# EasyEDA Pro project ProPrj_Neon_2025-07-07.epro

# Schematic Schematic1
Board Name: Board1; Create Date: 2025-03-22; Page Name: P1; Project Name: Neon; Schematic Name: Schematic1; Update Date: 2025-03-23; Company: EasyEDA.com; Page Size: A4; Version: V1.0
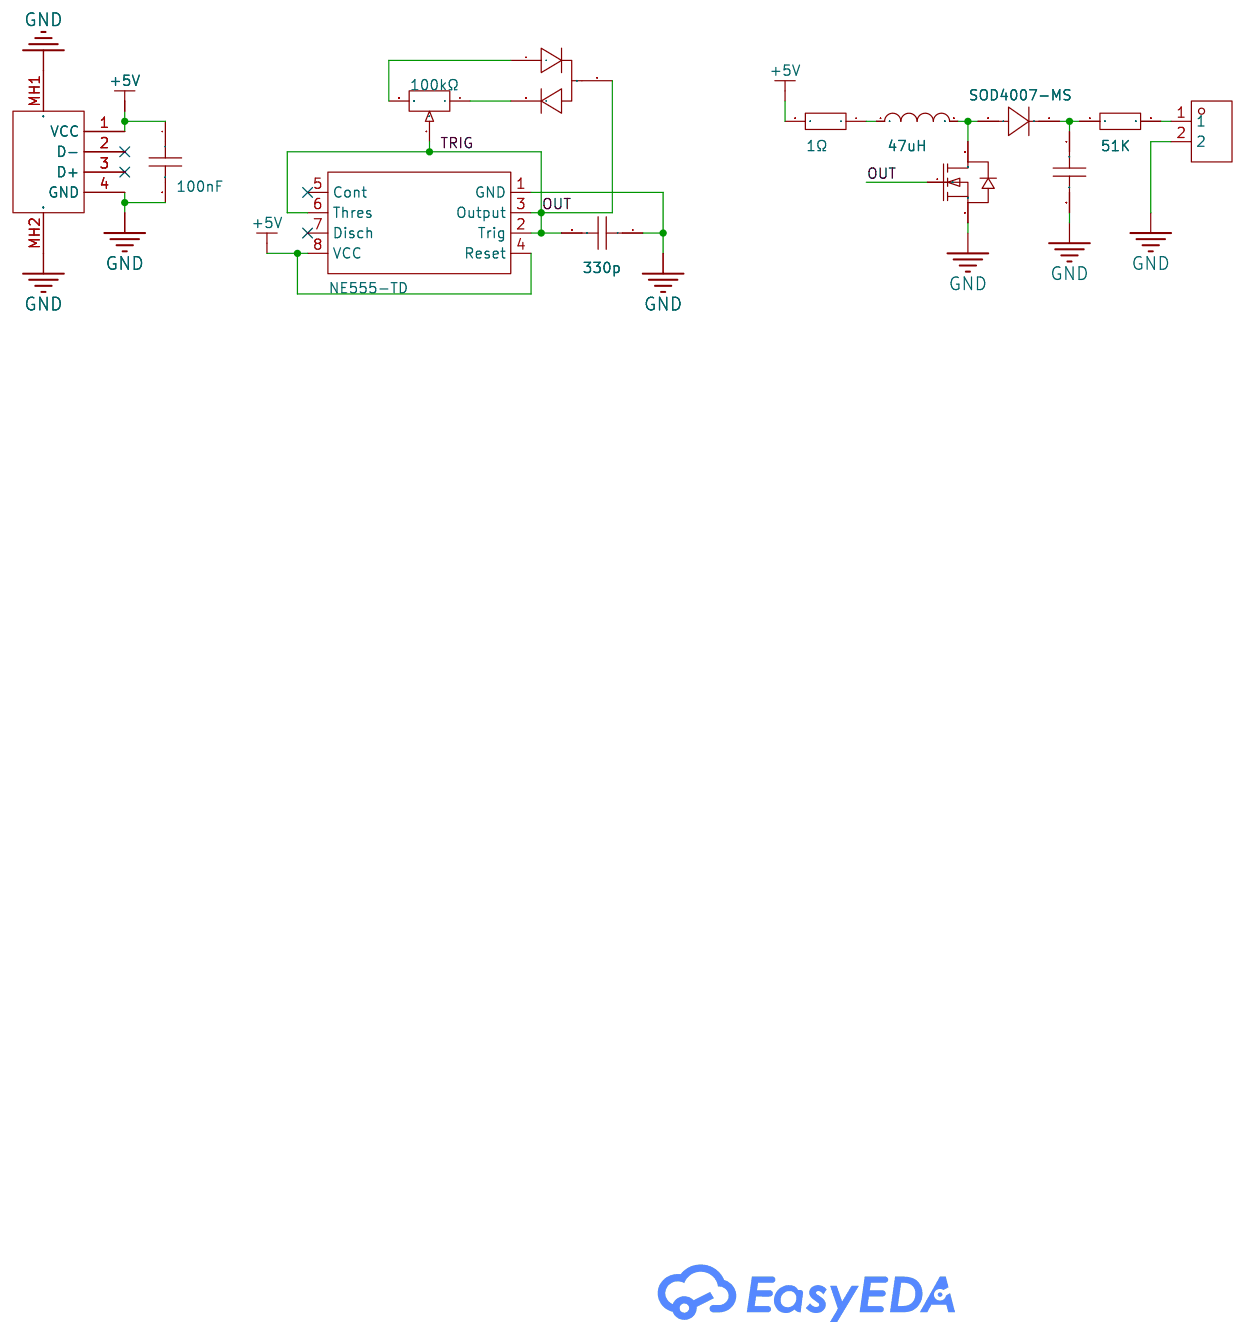
[diagram p0: schematic sheet]

## Parts
C1  330p  [C0603]
C2  100nF  [C0805]
C3  100nF  [C0603]
D2  SOD4007-MS  [SOD-123FL_L2.8-W1.8-LS3.7-RD]
Q1  BSS123W  [SOT-323-3_L2.0-W1.3-P1.30-LS2.3-BR]
R3  51K  [R0603]
R4  100kΩ  [RES-ADJ-TH_3P-L9.5-W4.9-P2.50-L_3296W]
R5  1Ω  [R0603]
U2  NE555-TD  [SOIC-8_L4.9-W3.9-P1.27-LS6.0-BL]
U3  DS1024-1x2R2  [HDR-TH_2P-P2.54-H-F-W10.0-N]
U4  BAV99  [SOT-23-3_L3.0-W1.7-P0.95-LS2.9-BR]
U5  47uH  [IND-TH_BD3.2-L7.0-P11.00-D0.5]
USB1  AM90  [USB-AM-TH_AM90]

## Library data of the parts
C1 C3 = CAP_0603: Supplier Footprint: 0603
C2 = AC0805JKX7R0BB104: Capacitance:100nF Tolerance:±5% Tolerance:±5% Voltage Rated: Temperature Coefficient:; LCSC Part Name: 100nF ±5% 100V; Supplier Part: C5936644; Manufacturer: YAGEO(国巨); Supplier Footprint: 0805; JLCPCB Part Class: Extended Part; Datasheet: https://atta.szlcsc.com/upload/public/pdf/source/20231121/23273F16EF68B848105A6B3182EA85EC.pdf; Supplier: LCSC; Tolerance: ±5%
D2 = SOD4007-MS: Diode Configuration: Reverse Voltage (Vr): Rectified Current: Reverse Leakage Current:10uA@1kV; LCSC Part Name: 电压:1kV 电流:1A; Supplier Part: C3008061; Manufacturer: MSKSEMI(美森科); Supplier Footprint: SOD-123FL; JLCPCB Part Class: Extended Part; Datasheet: https://atta.szlcsc.com/upload/public/pdf/source/20240508/03BE9FB150B205AAD58E954247BADD6D.pdf; Supplier: LCSC; Reverse Leakage Current: 10uA@1kV
Q1 = BSS123W: Type:1 N-channel Drain to Source Voltage: Current - Continuous Drain(Id): RDS(on):5.5Ω@4.5V,200mA Pd - Power Dissipation:150mW Gate Threshold Voltage (Vgs(th)@Id):2.5V Gate Charge(Qg):1.61nC@10V Input Capacitance(Ciss@Vds):32pF@50V Reverse Transfer Capaci; LCSC Part Name: 1个N沟道 耐压:100V 电流:200mA; Supplier Part: C919596; Manufacturer: YANGJIE(扬杰); Supplier Footprint: SOT-323(SC-70); JLCPCB Part Class: Extended Part; Datasheet: https://atta.szlcsc.com/upload/public/pdf/source/20201124/C919596_CD6FE2354D75AC43176E1098F69705B3.pdf; Supplier: LCSC; Type: 1 N-channel; RDS(on): 5.5Ω@4.5V,200mA; Pd - Power Dissipation: 150mW; Gate Threshold Voltage (Vgs(th)@Id): 2.5V; Gate Charge(Qg): 1.61nC@10V; Input Capacitance(Ciss@Vds): 32pF@50V; Reverse Transfer Capacitance (Crss@Vds): 7pF@50V; Operating Temperature: -55℃~+150℃
R3 = Res_0603: Supplier Footprint: 0603
R4 = 3296W-1-104_C118963: Resistance: Tolerance:±10% Tolerance:±10%; LCSC Part Name: 100kΩ ±10%; Supplier Part: C118963; Manufacturer: BOCHEN(博晨); Manufacturer Part: 3296W-1-104; Supplier Footprint: 插件; JLCPCB Part Class: Extended Part; Datasheet: https://atta.szlcsc.com/upload/public/pdf/source/20171114/C118963_15106326662041117450.pdf; Supplier: LCSC; Tolerance: ±10%
R5 = 0603WAF100KT5E: Type:Thick Film Resistors Resistance:1Ω Tolerance:±1% Tolerance:±1% Power(Watts): Overload Voltage (Max): Temperature Coefficient:±400ppm/℃ Temperature Coefficient:±400ppm/℃ Operating Temperature Range:-55℃~+155℃ Operating Temperature Range:-55℃~+155℃; LCSC Part Name: 1Ω ±1% 100mW 厚膜电阻; Supplier Part: C22936; Manufacturer: UNI-ROYAL(厚声); Supplier Footprint: 0603; JLCPCB Part Class: Basic Part; Datasheet: https://atta.szlcsc.com/upload/public/pdf/source/20200306/C422600_1E6D84923E4A46A82E41ADD87F860B5C.pdf; Supplier: LCSC; Type: Thick Film Resistors; Tolerance: ±1%; Temperature Coefficient: ±400ppm/℃; Operating Temperature Range: -55℃~+155℃
U2 = NE555-TD: Supplier Part: C42422057; Manufacturer: TDSEMIC(拓电半导体); Supplier Footprint: SOP-8; Datasheet: https://atta.szlcsc.com/upload/public/pdf/source/20241227/C1D0D1A1D654F129099568FEFDC0EC25.pdf; Supplier: LCSC
U3 = DS1024-1x2R2: Holes Structure:1x2P Pitch:2.54mm Mounting Type:Bend insert Number of Rows:Single Row Insulation Height:8.5mm Contact Plating:Nickel-plated; LCSC Part Name: 1x2P 间距:2.54mm 弯插 黑色; Supplier Part: C7509534; Manufacturer: CONNFLY; Supplier Footprint: 插件,P=2.54mm; JLCPCB Part Class: Extended Part; Datasheet: https://atta.szlcsc.com/upload/public/pdf/source/20230815/180A52BFD6617A57EE4D56A5DDB489B2.pdf; Supplier: LCSC; Holes Structure: 1x2P; Pitch: 2.54mm; Mounting Type: Bend insert; Number of Rows: Single Row; Insulation Height: 8.5mm; Contact Plating: Nickel-plated
U4 = BAV99_C22368863: Supplier Part: C22368863; Manufacturer: Wild Goose(威谷); Supplier Footprint: SOT-23; JLCPCB Part Class: Extended Part; Datasheet: https://atta.szlcsc.com/upload/public/pdf/source/20240624/F48F9993A5D8974EF570BB85214962A7.pdf; Supplier: LCSC
U5 = EC0410-470K: Inductance:47uH Tolerance:±10% Tolerance:±10% Current Rating:340mA DC Resistance(DCR):1.22Ω Type:Color Circle Coils Inductor Q @ Frequency:45@2.52MHz; Supplier Part: C19633460; Manufacturer: SXN(顺翔诺); Supplier Footprint: 插件,D4xL10.5mm; JLCPCB Part Class: Extended Part; Datasheet: https://atta.szlcsc.com/upload/public/pdf/source/20231211/F4FEA0398C091F67DBBAD1ED613298AE.pdf; Supplier: LCSC; Tolerance: ±10%; Current Rating: 340mA; DC Resistance(DCR): 1.22Ω; Type: Color Circle Coils Inductor; Q @ Frequency: 45@2.52MHz
USB1 = AM90: Connector Type:Type-A Standard:USB 2.0 Gender:Public Mounting Style:Bend-in Number of Contacts:4P Number of Ports:1 Current Rating - Power (Max):1.5A Rated Voltage (Max):30V Connect-Disconnect Life:5000 Cuts Supplementary Features:- Center Height:- Length; LCSC Part Name: Type-A 公 弯插; Supplier Part: C404965; Manufacturer: SHOU HAN(首韩); Supplier Footprint: 插件; JLCPCB Part Class: Extended Part; Datasheet: https://atta.szlcsc.com/upload/public/pdf/source/20190722/C404965_9CC10BE28E3F9E5134758D030387C529.pdf; Supplier: LCSC; Connector Type: Type-A; Standard: USB 2.0; Gender: Public; Mounting Style: Bend-in; Number of Contacts: 4P; Number of Ports: 1; Current Rating - Power (Max): 1.5A; Rated Voltage (Max): 30V; Connect-Disconnect Life: 5000 Cuts; Length: 18.8mm; Core Colour: White; Operating Temperature Range: -25℃~+85℃

## Nets
+5V: C3.1 R5.2 U2.4(Reset) U2.8(VCC) USB1.1(VCC)
GND: C1.1 C2.2 C3.2 Q1.2(S) U2.1(GND) U3.2 USB1.4(GND) USB1.MH1 USB1.MH2
OUT: Q1.1(G) U2.3(Output) U4.3(C)
TRIG: C1.2 R4.2 U2.2(Trig) U2.6(Thres)
$1N996: D2.2(A) Q1.3(D) U5.2
$1N1148: C2.1 D2.1(K) R3.1
$1N1405: R3.2 U3.1
$1N1856: R4.1 U4.2(A)
$1N1862: R4.3 U4.1(A)
$1N2753: R5.1 U5.1

Not connected (* = marked no-connect by the designer): U2 5(Cont)* 7(Disch)*; USB1 2(D-)* 3(D+)*

# Board PCB1
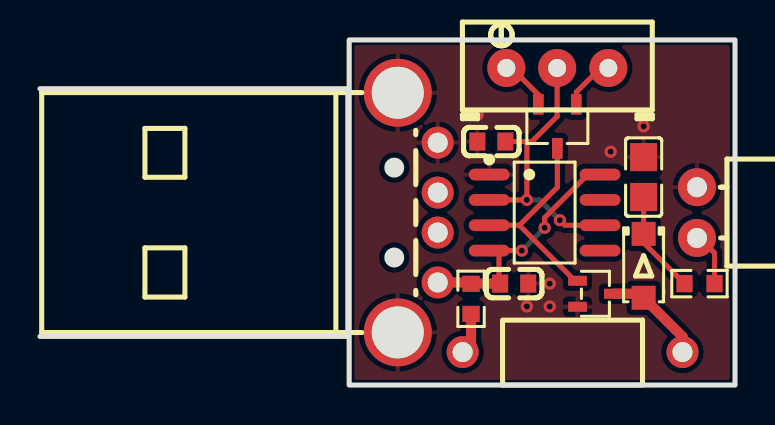
[diagram p1: board, top side]
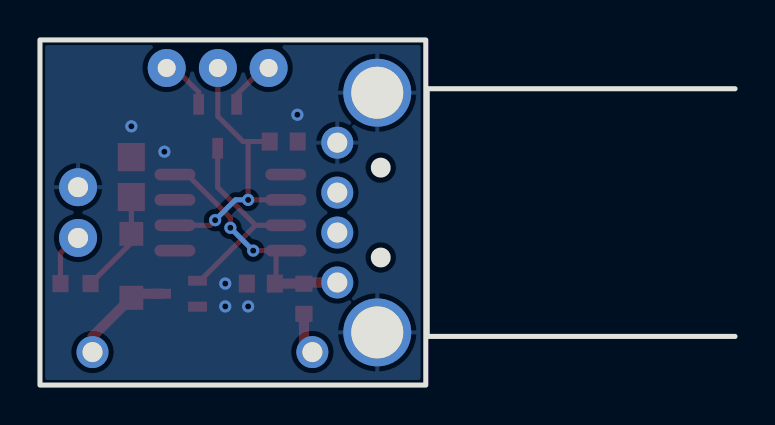
[diagram p2: board, bottom side, seen from below]

Outline 34.78 x 17.28 mm; copper layers: Top Layer, Bottom Layer. Coordinates in mm from the lower left corner of the outline.
Outline path: rectangle 15.47,17.28 34.78,0
Stack: Top Layer 0.035mm / Dielectric1 1.51mm FR4 er 4.5 / Bottom Layer 0.035mm

## Design rules (mm)
template: JLCPCB Capability(Two Layers Board)
spacing copperThickness1oz (default): track to track 0.102, other pairs 0.152 to 0.3
spacing copperThickness2oz: track to track 0.203, other pairs 0.152 to 0.3
track width copperThickness1oz (default): min 0.127, default 0.254, max 2.54
track width copperThickness2oz: min 0.203, default 0.254, max 2.54
differential pair differentialPair (default): width min 0.127, default 0.254, max 2.54; gap min 0.152, default 0.152
via viaSize (default): diameter min 0.5, default 0.61, max 10; hole min 0.3, default 0.305, max 6.3

## Placement (name value [footprint] x y rotation side)
C1  330p  [C0603]  22.58 12.19 0 top
C2  100nF  [C0805]  30.2 10.41 90 top
C3  100nF  [C0603]  23.73 5.08 0 top
D2  SOD4007-MS  [SOD-123FL_L2.8-W1.8-LS3.7-RD]  30.2 5.97 270 top
Q1  BSS123W  [SOT-323-3_L2.0-W1.3-P1.30-LS2.3-BR]  27.79 4.57 180 top
R3  51K  [R0603]  33 5.08 0 top
R4  100kΩ  [RES-ADJ-TH_3P-L9.5-W4.9-P2.50-L_3296W]  25.89 15.88 0 top
R5  1Ω  [R0603]  21.57 4.32 90 top
U2  NE555-TD  [SOIC-8_L4.9-W3.9-P1.27-LS6.0-BL]  25.25 8.64 270 top
U3  DS1024-1x2R2  [HDR-TH_2P-P2.54-H-F-W10.0-N]  32.87 8.64 90 top
U4  BAV99  [SOT-23-3_L3.0-W1.7-P0.95-LS2.9-BR]  25.89 12.95 90 top
U5  47uH  [IND-TH_BD3.2-L7.0-P11.00-D0.5]  26.65 1.65 0 top
USB1  AM90  [USB-AM-TH_AM90]  18.9 8.64 270 top

## Footprints (pads in the part's own frame, mm; a bottom-side part is the same pattern mirrored in y, then rotated)
C0603
  rect 0.8x0.9 smd: 1(-0.7,0) 2(0.7,0)
C0805
  rect 1.41x1.35 smd: 1(-1,0) 2(1,0)
HDR-TH_2P-P2.54-H-F-W10.0-N
  round 1.9 hole 1: 1(-1.27,0) 2(1.27,0)
IND-TH_BD3.2-L7.0-P11.00-D0.5
  round 1.6 hole 1: 1(-5.5,0) 2(5.5,0)
R0603
  rect 0.806x0.864 smd: 1(-0.753,0) 2(0.753,0)
RES-ADJ-TH_3P-L9.5-W4.9-P2.50-L_3296W
  round 1.9 hole 0.9: 1(-2.55,0) 2(-0.01,0) 3(2.55,0)
SOD-123FL_L2.8-W1.8-LS3.7-RD
  rect 1.2x1.2 smd: 1(-1.6,0) 2(1.6,0)
SOIC-8_L4.9-W3.9-P1.27-LS6.0-BL
  oval 0.588x2.045 smd: 1(-1.905,-2.772) 2(-0.635,-2.772) 3(0.635,-2.772) 4(1.905,-2.772) 5(1.905,2.772) 6(0.635,2.772) 7(-0.635,2.772) 8(-1.905,2.772)
SOT-23-3_L3.0-W1.7-P0.95-LS2.9-BR
  rect 1.038x0.532 smd: 1(1.101,-0.95) 2(1.101,0.95) 3(-1.101,0)
SOT-323-3_L2.0-W1.3-P1.30-LS2.3-BR
  rect 0.936x0.5 smd: 1(0.898,-0.65) 2(0.898,0.65) 3(-0.898,0)
USB-AM-TH_AM90
  round 1.6 hole 1: 1(3.5,1) 2(1,1) 3(-1,1) 4(-3.5,1)
  round 3.4 hole 2.6: MH1(6,-1) MH2(-6,-1)

## Nets
As in the schematic.

Pads without a net: U2 5 7; USB1 2 3

## Via types
v1: diameter 0.61, hole 0.305, Top Layer to Bottom Layer, 10 vias

## Routing (per net, layer and track width the routed paths; a pad name or vN(x,y) marks a point on that pad's centre or on a via; arc(x,y) is an arc through that point)
+5V: length 12.2
  Top Layer w0.254: U2.4 22.87,6.73 ; 22.87,6.73 v1(24.11,6.73) ; 22.87,6.73 22.96,6.63 22.96,5.14 22.9,5.08 ; v1(25.25,7.87) 25.25,8.38 27.41,10.54 U2.8
  Top Layer w0.508: 22.9,5.08 21.58,5.08 R5.2 21.5,5.14 USB1.1
  Bottom Layer w0.254: v1(25.25,7.87) v1(24.11,6.73)
GND:
  vias: v1(21.9,13.53) v1(24.36,3.94) v1(25.5,5.08) v1(25.5,3.94) v1(28.55,11.68) v1(30.2,12.95)
OUT: length 9.9
  Top Layer w0.254: U2.3 23.99,8 ; 23.99,8 25.89,9.9 U4.3 ; 23.99,8 26.64,5.35
TRIG: length 14.2
  Top Layer w0.254: U2.6 26.27,8 v1(26.01,8.25) ; 24.38,12.19 24.36,12.18 v1(24.36,9.27) U2.2 ; 24.38,12.19 C1.2 ; 24.38,12.19 24.62,12.19 25.88,13.45 25.88,15.49
  Bottom Layer w0.254: v1(24.36,9.27) 25,9.27 v1(26.01,8.25)
$1N996: length 5.1
  Top Layer w0.508: Q1.3 30,4.57 D2.2 32.15,2.42 U5.2
$1N1148: length 5.2
  Top Layer w0.254: R3.1 30.2,7.12 C2.1
$1N1405: length 2.8
  Top Layer w0.254: R3.2 33.75,6.61 32.87,7.49
$1N1856: length 2.5
  Top Layer w0.254: 23.34,15.49 23.98,15.49 24.94,14.54 U4.2
$1N1862: length 2.6
  Top Layer w0.254: 28.44,15.49 27.66,15.49 26.84,14.67 U4.1
$1N2753: length 1.8
  Top Layer w0.508: 21.57,3.31 21.57,2.07 U5.1

## Copper pours and planes (outline as drawn; the poured copper is in the pictures)
GND on Top Layer: 15.47,17.28 34.78,17.28 34.78,0 15.47,0
GND on Bottom Layer: 15.47,17.28 34.78,17.28 34.78,0 15.47,0
